# Altium schematic sheet rs232_usart.SchDoc
size A4; Engineer: Amir Hossein Jobeiri; Organization: Simaran; SheetNumber: 2; SheetTotal: 25
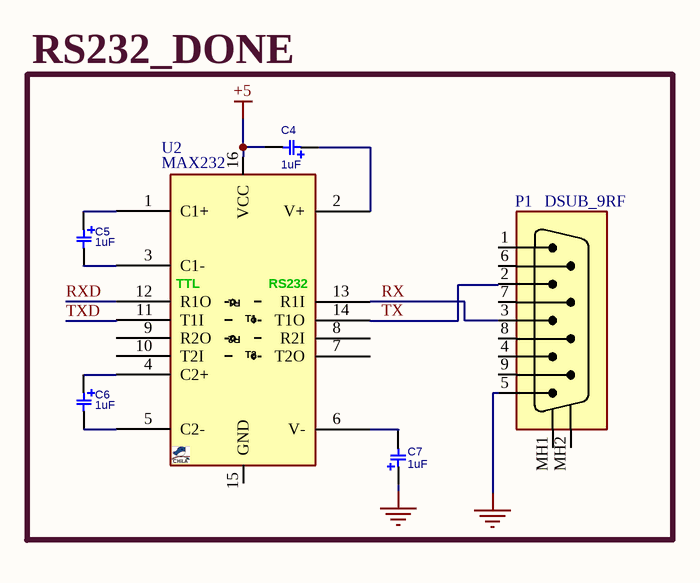
[diagram p0: rs232_usart.SchDoc]

## Parts
C4  1uF  [C_EL_4X7]
C5  1uF  [C_EL_4X7]
C6  1uF  [C_EL_4X7]
C7  1uF  [C_EL_4X7]
P1  DSUB_9RF  [DSUB_9RF]
U2  MAX232  [DIP_16]

## Blocks framed on the sheet
RS232_DONE: C4-C7 P1 U2

## Nets
+5: C4.2 U2.16(VCC)
GND: C7.1 P1.5
RX: P1.3 U2.13(R1I)
RXD: U2.12(R1O)
TX: P1.2 U2.14(T1O)
TXD: U2.11(T1I)
NetC4_1: C4.1 U2.2(V+)
NetC5_1: C5.1 U2.1(C1+)
NetC5_2: C5.2 U2.3(C1-)
NetC6_1: C6.1 U2.4(C2+)
NetC6_2: C6.2 U2.5(C2-)
NetC7_2: C7.2 U2.6(V-)

Not connected (* = marked no-connect by the designer): P1 1 4 6 7 8 9 MH1 MH2; U2 7(T2O) 8(R2I) 9(R2O) 10(T2I) 15(GND)

## Notes on the sheet
- (in symbol MAX232_DIP16) TTL; RS232; R1; T1; R2; T2

## Library data of the parts
C4-C7 = CAP_THD_EL_10u25V: CAP, THD, ELEC, 10uF, 25V; MANF_P#: MANF_PART#; PARAM: 25V; MANF: MANF; PARAM2: PARAM2; VALUE: 1uF
P1 = CONN_DSUB_9RF: CONN, DSUB, HD, 9PIN, R/A, FEMALE, THD; MANF_P#: -; MANF: -; VALUE: DSUB_9RF
U2 = MAX232_DIP16: RS-232, DUAL, +5V, Driver/Receiver; MANF_PART#: MAX232N, MAX232ACPE; MANF: Texas Instruments, Maxim Integrated; PARAM: PARAM; PRICE: 1500toman@PAYA; VALUE: MAX232